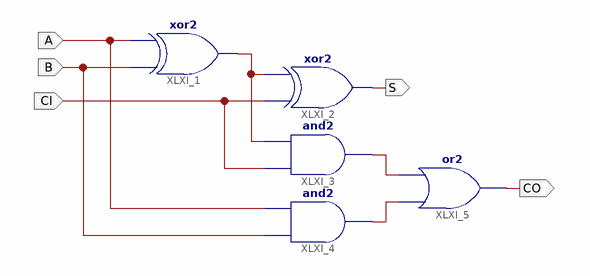
[diagram p0: schematic sheet 1]
// Xilinx ISE schematic FullAdder1Bit.sch (spartan6) as structural Verilog: 5 symbols, 5 ports
module FullAdder1Bit (
  input  A,
  input  B,
  input  CI,
  output S,
  output CO
);

  wire XLXN_4, XLXN_9, XLXN_10;

  xor XLXI_1 (XLXN_4, B, A);
  xor XLXI_2 (S, CI, XLXN_4);
  and XLXI_3 (XLXN_9, CI, XLXN_4);
  and XLXI_4 (XLXN_10, B, A);
  or XLXI_5 (CO, XLXN_10, XLXN_9);
endmodule
